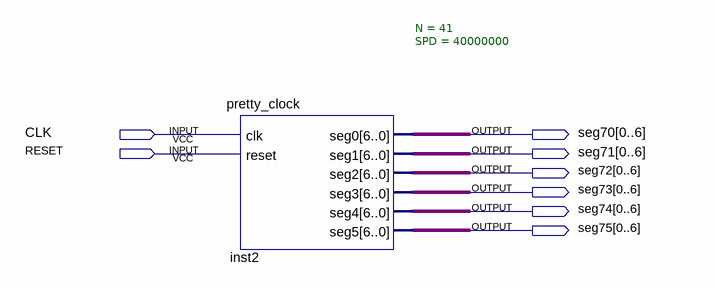
[diagram p0: schematic sheet]
// Quartus schematic Lab5.bdf as structural Verilog: 1 symbols, 8 pins
module Lab5 (
  input  CLK,
  input  RESET,
  output [0:6] seg70,
  output [0:6] seg71,
  output [0:6] seg72,
  output [0:6] seg73,
  output [0:6] seg74,
  output [0:6] seg75
);

  pretty_clock #(.N(41), .SPD(40000000)) inst2 (
    .clk(CLK), .reset(RESET), .seg0(seg70), .seg1(seg71), .seg2(seg72), .seg3(seg73), .seg4(seg74),
    .seg5(seg75));
endmodule
